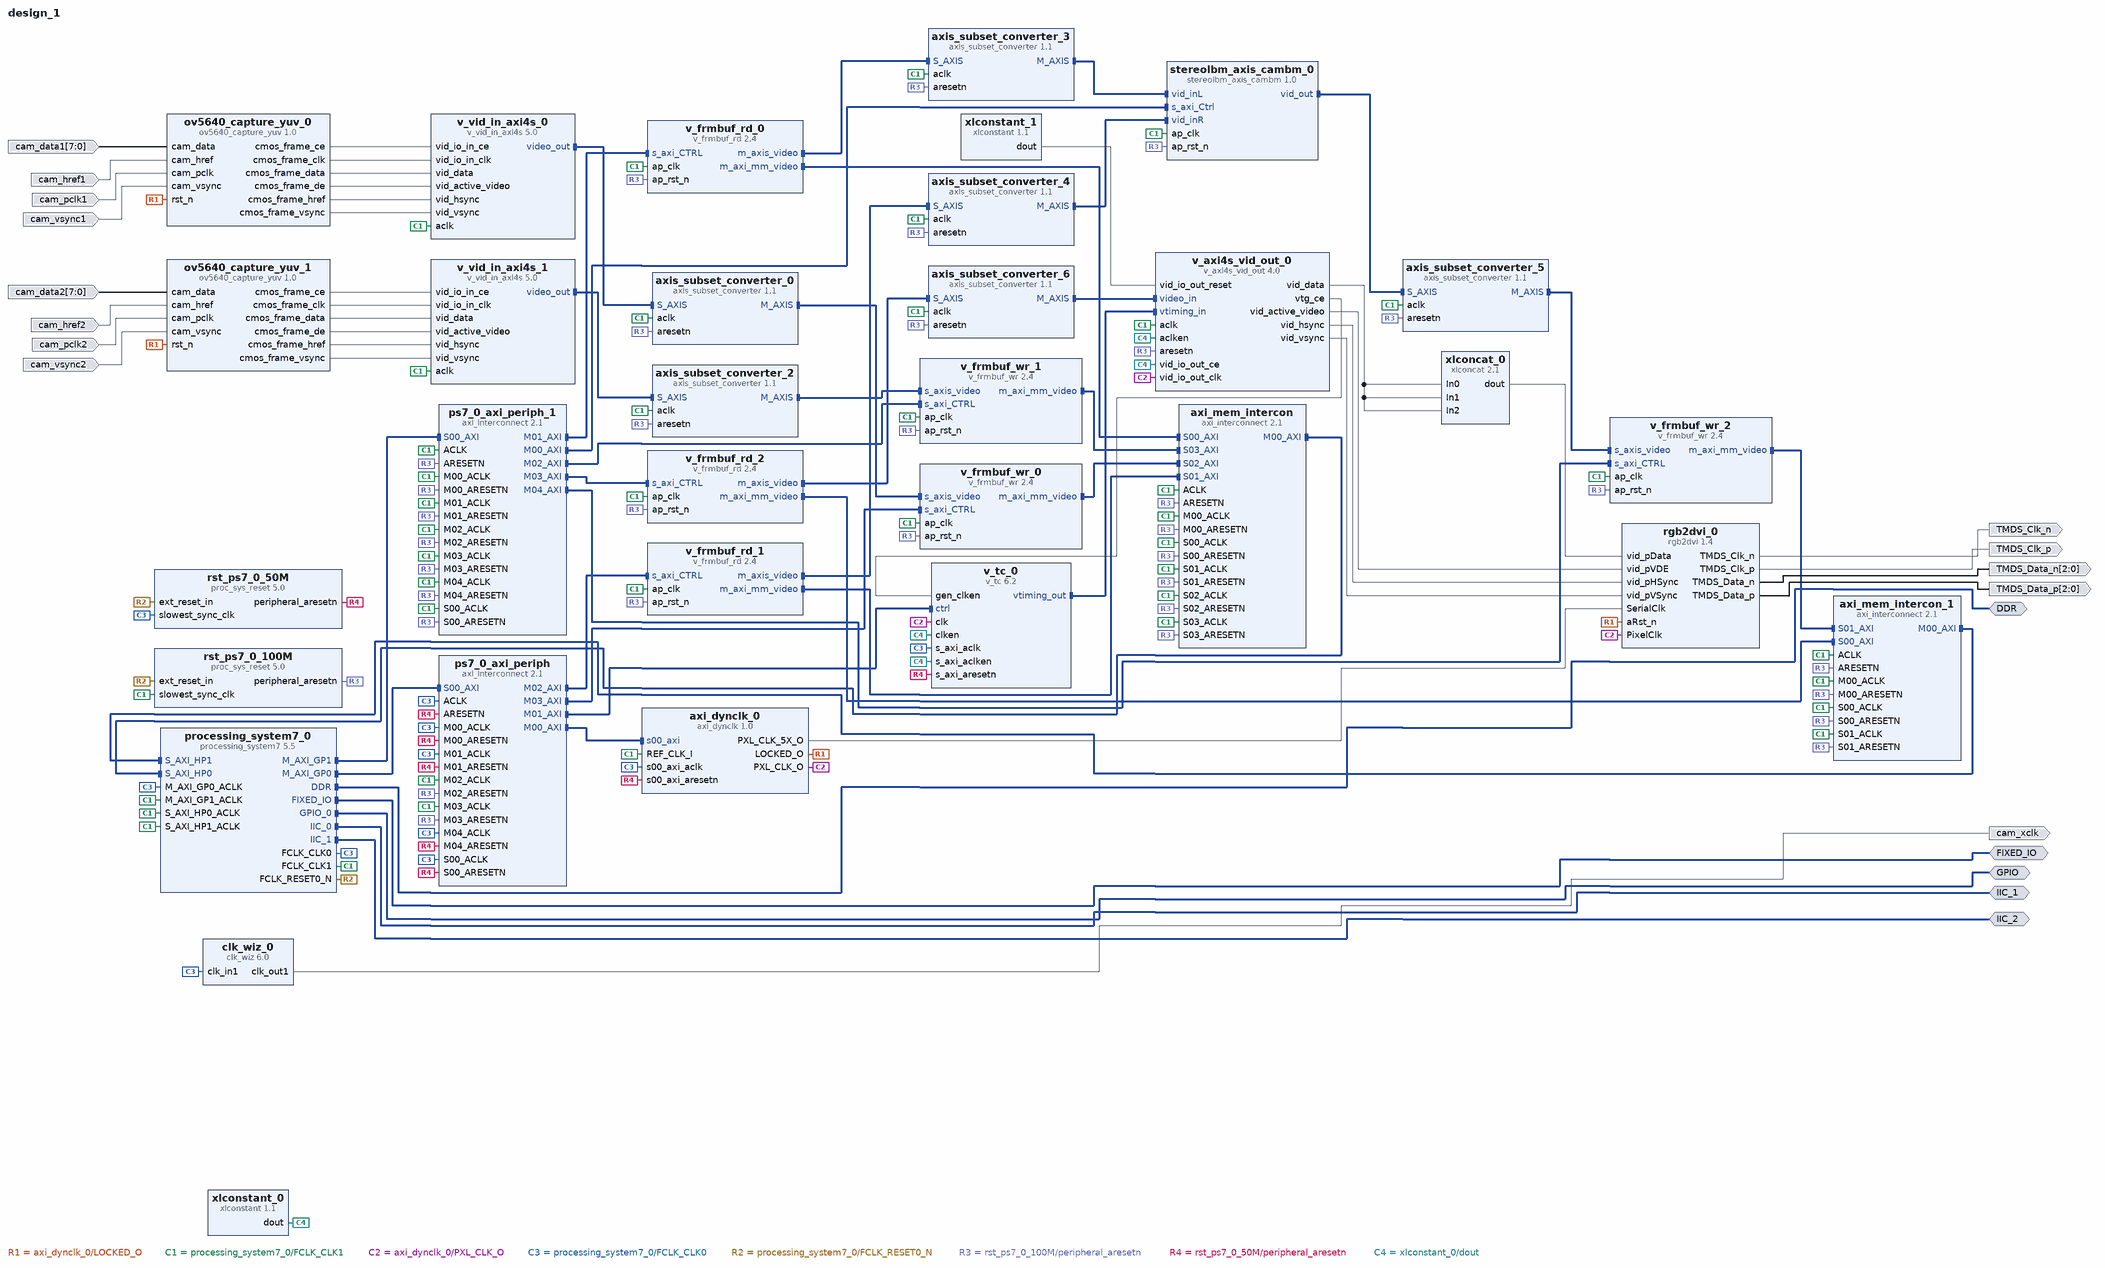
[diagram p0: block diagram of the top level]
# Vivado block design design_1, xc7z020clg400-1, Vivado 2023.1
create_bd_design design_1

create_bd_intf_port -mode Master -vlnv xilinx.com:interface:gpio_rtl:1.0 GPIO
create_bd_intf_port -mode Master -vlnv xilinx.com:interface:ddrx_rtl:1.0 DDR
create_bd_intf_port -mode Master -vlnv xilinx.com:display_processing_system7:fixedio_rtl:1.0 FIXED_IO
create_bd_intf_port -mode Master -vlnv xilinx.com:interface:iic_rtl:1.0 IIC_1
create_bd_intf_port -mode Master -vlnv xilinx.com:interface:iic_rtl:1.0 IIC_2
create_bd_port -dir O -type clk TMDS_Clk_p
create_bd_port -dir O -type clk TMDS_Clk_n
create_bd_port -dir O -from 2 -to 0 TMDS_Data_p
create_bd_port -dir O -from 2 -to 0 TMDS_Data_n
create_bd_port -dir I cam_pclk1
create_bd_port -dir I cam_vsync1
create_bd_port -dir I cam_href1
create_bd_port -dir I -from 7 -to 0 cam_data1
create_bd_port -dir O -type clk cam_xclk
create_bd_port -dir I -from 7 -to 0 cam_data2
create_bd_port -dir I cam_href2
create_bd_port -dir I cam_vsync2
create_bd_port -dir I cam_pclk2

create_bd_cell -type ip -vlnv xilinx.com:ip:v_tc:6.2 v_tc_0
set_property -dict {CONFIG.HAS_AXI4_LITE true CONFIG.VIDEO_MODE 720p CONFIG.enable_detection false} [get_bd_cells v_tc_0]
create_bd_cell -type ip -vlnv xilinx.com:ip:v_axi4s_vid_out:4.0 v_axi4s_vid_out_0
set_property -dict [list \
  CONFIG.C_ADDR_WIDTH 11 \
  CONFIG.C_HAS_ASYNC_CLK 1 \
  CONFIG.C_PIXELS_PER_CLOCK 1 \
  CONFIG.C_S_AXIS_VIDEO_FORMAT 12 \
] [get_bd_cells v_axi4s_vid_out_0]
create_bd_cell -type ip -vlnv xilinx.com:ip:xlconstant:1.1 xlconstant_0
set_property -dict {CONFIG.CONST_VAL 1} [get_bd_cells xlconstant_0]
create_bd_cell -type ip -vlnv xilinx.com:ip:proc_sys_reset:5.0 rst_ps7_0_100M
create_bd_cell -type ip -vlnv digilentinc.com:ip:rgb2dvi:1.4 rgb2dvi_0
set_property -dict {CONFIG.kGenerateSerialClk false CONFIG.kRstActiveHigh false} [get_bd_cells rgb2dvi_0]
create_bd_cell -type ip -vlnv digilentinc.com:ip:axi_dynclk:1.0 axi_dynclk_0
create_bd_cell -type ip -vlnv xilinx.com:ip:proc_sys_reset:5.0 rst_ps7_0_50M
create_bd_cell -type ip -vlnv xilinx.com:ip:xlconstant:1.1 xlconstant_1
set_property -dict {CONFIG.CONST_VAL 0} [get_bd_cells xlconstant_1]
create_bd_cell -type ip -vlnv xilinx.com:ip:v_frmbuf_wr:2.4 v_frmbuf_wr_0
set_property -dict [list \
  CONFIG.AXIMM_ADDR_WIDTH 32 \
  CONFIG.HAS_INTERLACED 0 \
  CONFIG.HAS_RGB8 0 \
  CONFIG.HAS_RGBX8 0 \
  CONFIG.HAS_Y8 1 \
  CONFIG.HAS_YUVX8 0 \
  CONFIG.HAS_YUYV8 0 \
  CONFIG.HAS_Y_U_V8 0 \
  CONFIG.MAX_COLS 4096 \
  CONFIG.MAX_DATA_WIDTH 8 \
  CONFIG.SAMPLES_PER_CLOCK 1 \
] [get_bd_cells v_frmbuf_wr_0]
create_bd_cell -type ip -vlnv xilinx.com:ip:v_frmbuf_rd:2.4 v_frmbuf_rd_0
set_property -dict [list \
  CONFIG.AXIMM_ADDR_WIDTH 32 \
  CONFIG.HAS_ALPHA 0 \
  CONFIG.HAS_INTERLACED 0 \
  CONFIG.HAS_RGB8 0 \
  CONFIG.HAS_RGBX8 0 \
  CONFIG.HAS_UYVY8 0 \
  CONFIG.HAS_Y8 1 \
  CONFIG.HAS_YUVX8 0 \
  CONFIG.HAS_YUYV8 0 \
  CONFIG.MAX_COLS 4096 \
  CONFIG.MAX_DATA_WIDTH 8 \
  CONFIG.SAMPLES_PER_CLOCK 1 \
] [get_bd_cells v_frmbuf_rd_0]
create_bd_cell -type ip -vlnv xilinx.com:ip:v_vid_in_axi4s:5.0 v_vid_in_axi4s_0
set_property -dict [list \
  CONFIG.C_ADDR_WIDTH 11 \
  CONFIG.C_HAS_ASYNC_CLK 1 \
  CONFIG.C_M_AXIS_VIDEO_FORMAT 0 \
] [get_bd_cells v_vid_in_axi4s_0]
create_bd_cell -type ip -vlnv xilinx.com:ip:clk_wiz:6.0 clk_wiz_0
set_property -dict [list \
  CONFIG.CLKIN1_JITTER_PS 200.0 \
  CONFIG.CLKIN2_JITTER_PS 100.0 \
  CONFIG.CLKOUT1_JITTER 239.726 \
  CONFIG.CLKOUT1_PHASE_ERROR 160.484 \
  CONFIG.CLKOUT1_REQUESTED_OUT_FREQ 24 \
  CONFIG.MMCM_CLKFBOUT_MULT_F 19.500 \
  CONFIG.MMCM_CLKIN1_PERIOD 20.000 \
  CONFIG.MMCM_CLKIN2_PERIOD 10.0 \
  CONFIG.MMCM_CLKOUT0_DIVIDE_F 40.625 \
  CONFIG.MMCM_DIVCLK_DIVIDE 1 \
  CONFIG.PRIM_IN_FREQ 50.000 \
  CONFIG.SECONDARY_SOURCE Single_ended_clock_capable_pin \
  CONFIG.USE_INCLK_SWITCHOVER false \
  CONFIG.USE_LOCKED false \
  CONFIG.USE_RESET false \
] [get_bd_cells clk_wiz_0]
create_bd_cell -type ip -vlnv xilinx.com:ip:processing_system7:5.5 processing_system7_0
set_property -dict [list \
  CONFIG.PCW_APU_PERIPHERAL_FREQMHZ 650 \
  CONFIG.PCW_CRYSTAL_PERIPHERAL_FREQMHZ 50 \
  CONFIG.PCW_EN_CLK1_PORT 1 \
  CONFIG.PCW_FCLK_CLK1_BUF TRUE \
  CONFIG.PCW_FPGA1_PERIPHERAL_FREQMHZ 100 \
  CONFIG.PCW_FPGA_FCLK1_ENABLE 1 \
  CONFIG.PCW_GPIO_EMIO_GPIO_ENABLE 1 \
  CONFIG.PCW_GPIO_EMIO_GPIO_IO 3 \
  CONFIG.PCW_GPIO_EMIO_GPIO_WIDTH 3 \
  CONFIG.PCW_I2C0_I2C0_IO EMIO \
  CONFIG.PCW_I2C0_PERIPHERAL_ENABLE 1 \
  CONFIG.PCW_I2C1_I2C1_IO EMIO \
  CONFIG.PCW_I2C1_PERIPHERAL_ENABLE 1 \
  CONFIG.PCW_I2C_PERIPHERAL_FREQMHZ 108.333336 \
  CONFIG.PCW_PRESET_BANK1_VOLTAGE {LVCMOS 1.8V} \
  CONFIG.PCW_SD0_GRP_CD_ENABLE 1 \
  CONFIG.PCW_SD0_GRP_CD_IO {MIO 47} \
  CONFIG.PCW_SD0_GRP_WP_ENABLE 0 \
  CONFIG.PCW_SD0_PERIPHERAL_ENABLE 1 \
  CONFIG.PCW_SD0_SD0_IO {MIO 40 .. 45} \
  CONFIG.PCW_SDIO_PERIPHERAL_FREQMHZ 100 \
  CONFIG.PCW_UART0_PERIPHERAL_ENABLE 1 \
  CONFIG.PCW_UART0_UART0_IO {MIO 14 .. 15} \
  CONFIG.PCW_UART_PERIPHERAL_FREQMHZ 100 \
  CONFIG.PCW_UIPARAM_DDR_BUS_WIDTH {16 Bit} \
  CONFIG.PCW_UIPARAM_DDR_FREQ_MHZ 525 \
  CONFIG.PCW_UIPARAM_DDR_PARTNO {MT41J256M16 RE-125} \
  CONFIG.PCW_UIPARAM_GENERATE_SUMMARY NONE \
  CONFIG.PCW_USE_M_AXI_GP1 1 \
  CONFIG.PCW_USE_S_AXI_HP0 1 \
  CONFIG.PCW_USE_S_AXI_HP1 1 \
] [get_bd_cells processing_system7_0]
# 73 more settings of processing_system7_0 are not shown: defaults, MIO pin electricals, DDR timing, and values the tool derives
create_bd_cell -type ip -vlnv xilinx.com:user:ov5640_capture_yuv:1.0 ov5640_capture_yuv_0
create_bd_cell -type ip -vlnv xilinx.com:ip:xlconcat:2.1 xlconcat_0
set_property -dict {CONFIG.IN0_WIDTH 8 CONFIG.IN1_WIDTH 8 CONFIG.IN2_WIDTH 8 CONFIG.NUM_PORTS 3} [get_bd_cells xlconcat_0]
create_bd_cell -type ip -vlnv xilinx.com:user:ov5640_capture_yuv:1.0 ov5640_capture_yuv_1
create_bd_cell -type ip -vlnv xilinx.com:ip:v_vid_in_axi4s:5.0 v_vid_in_axi4s_1
set_property -dict [list \
  CONFIG.C_ADDR_WIDTH 11 \
  CONFIG.C_HAS_ASYNC_CLK 1 \
  CONFIG.C_M_AXIS_VIDEO_FORMAT 0 \
] [get_bd_cells v_vid_in_axi4s_1]
create_bd_cell -type ip -vlnv xilinx.com:ip:v_frmbuf_wr:2.4 v_frmbuf_wr_1
set_property -dict [list \
  CONFIG.AXIMM_ADDR_WIDTH 32 \
  CONFIG.HAS_INTERLACED 0 \
  CONFIG.HAS_RGB8 0 \
  CONFIG.HAS_RGBX8 0 \
  CONFIG.HAS_Y8 1 \
  CONFIG.HAS_YUVX8 0 \
  CONFIG.HAS_YUYV8 0 \
  CONFIG.HAS_Y_U_V8 0 \
  CONFIG.MAX_COLS 4096 \
  CONFIG.MAX_DATA_WIDTH 8 \
  CONFIG.SAMPLES_PER_CLOCK 1 \
] [get_bd_cells v_frmbuf_wr_1]
create_bd_cell -type ip -vlnv xilinx.com:ip:v_frmbuf_rd:2.4 v_frmbuf_rd_1
set_property -dict [list \
  CONFIG.AXIMM_ADDR_WIDTH 32 \
  CONFIG.HAS_ALPHA 0 \
  CONFIG.HAS_INTERLACED 0 \
  CONFIG.HAS_RGB8 0 \
  CONFIG.HAS_RGBX8 0 \
  CONFIG.HAS_UYVY8 0 \
  CONFIG.HAS_Y8 1 \
  CONFIG.HAS_YUVX8 0 \
  CONFIG.HAS_YUYV8 0 \
  CONFIG.MAX_COLS 4096 \
  CONFIG.MAX_DATA_WIDTH 8 \
  CONFIG.SAMPLES_PER_CLOCK 1 \
] [get_bd_cells v_frmbuf_rd_1]
create_bd_cell -type ip -vlnv xilinx.com:ip:axis_subset_converter:1.1 axis_subset_converter_0
set_property -dict [list \
  CONFIG.M_TDATA_NUM_BYTES 3 \
  CONFIG.S_TDATA_NUM_BYTES 2 \
  CONFIG.TDATA_REMAP {16'b0000000000000000,tdata[7:0]} \
] [get_bd_cells axis_subset_converter_0]
create_bd_cell -type ip -vlnv xilinx.com:ip:axis_subset_converter:1.1 axis_subset_converter_2
set_property -dict [list \
  CONFIG.M_TDATA_NUM_BYTES 3 \
  CONFIG.S_TDATA_NUM_BYTES 2 \
  CONFIG.TDATA_REMAP {16'b0000000000000000,tdata[7:0]} \
] [get_bd_cells axis_subset_converter_2]
create_bd_cell -type ip -vlnv xilinx.com:ip:axis_subset_converter:1.1 axis_subset_converter_3
set_property -dict {CONFIG.M_TDATA_NUM_BYTES 1 CONFIG.S_TDATA_NUM_BYTES 3} [get_bd_cells axis_subset_converter_3]
create_bd_cell -type ip -vlnv xilinx.com:ip:axis_subset_converter:1.1 axis_subset_converter_4
set_property -dict {CONFIG.M_TDATA_NUM_BYTES 1 CONFIG.S_TDATA_NUM_BYTES 3} [get_bd_cells axis_subset_converter_4]
create_bd_cell -type ip -vlnv xilinx.com:ip:axi_interconnect:2.1 ps7_0_axi_periph
set_property -dict {CONFIG.NUM_MI 5} [get_bd_cells ps7_0_axi_periph]
create_bd_cell -type ip -vlnv xilinx.com:ip:axi_interconnect:2.1 ps7_0_axi_periph_1
set_property -dict {CONFIG.NUM_MI 5} [get_bd_cells ps7_0_axi_periph_1]
create_bd_cell -type ip -vlnv xilinx.com:ip:v_frmbuf_wr:2.4 v_frmbuf_wr_2
set_property -dict [list \
  CONFIG.HAS_RGB8 0 \
  CONFIG.HAS_Y8 1 \
  CONFIG.MAX_COLS 4096 \
  CONFIG.SAMPLES_PER_CLOCK 1 \
] [get_bd_cells v_frmbuf_wr_2]
create_bd_cell -type ip -vlnv xilinx.com:ip:axis_subset_converter:1.1 axis_subset_converter_5
set_property -dict {CONFIG.M_TDATA_NUM_BYTES 3 CONFIG.S_TDATA_NUM_BYTES 1} [get_bd_cells axis_subset_converter_5]
create_bd_cell -type ip -vlnv xilinx.com:ip:v_frmbuf_rd:2.4 v_frmbuf_rd_2
set_property -dict [list \
  CONFIG.HAS_RGB8 0 \
  CONFIG.HAS_Y8 1 \
  CONFIG.MAX_COLS 4096 \
  CONFIG.SAMPLES_PER_CLOCK 1 \
] [get_bd_cells v_frmbuf_rd_2]
create_bd_cell -type ip -vlnv xilinx.com:ip:axis_subset_converter:1.1 axis_subset_converter_6
set_property -dict {CONFIG.M_TDATA_NUM_BYTES 1 CONFIG.S_TDATA_NUM_BYTES 3} [get_bd_cells axis_subset_converter_6]
create_bd_cell -type ip -vlnv xilinx.com:ip:axi_interconnect:2.1 axi_mem_intercon
set_property -dict {CONFIG.NUM_MI 1 CONFIG.NUM_SI 4} [get_bd_cells axi_mem_intercon]
create_bd_cell -type ip -vlnv xilinx.com:ip:axi_interconnect:2.1 axi_mem_intercon_1
set_property -dict {CONFIG.NUM_MI 1 CONFIG.NUM_SI 2} [get_bd_cells axi_mem_intercon_1]
create_bd_cell -type ip -vlnv xilinx.com:hls:stereolbm_axis_cambm:1.0 stereolbm_axis_cambm_0

# ---- connections ----

connect_bd_intf_net [get_bd_intf_pins axi_mem_intercon_1/M00_AXI] [get_bd_intf_pins processing_system7_0/S_AXI_HP1]
connect_bd_intf_net [get_bd_intf_pins axi_mem_intercon/M00_AXI] [get_bd_intf_pins processing_system7_0/S_AXI_HP0]
connect_bd_intf_net [get_bd_intf_pins axis_subset_converter_0/M_AXIS] [get_bd_intf_pins v_frmbuf_wr_0/s_axis_video]
connect_bd_intf_net [get_bd_intf_pins axis_subset_converter_2/M_AXIS] [get_bd_intf_pins v_frmbuf_wr_1/s_axis_video]
connect_bd_intf_net [get_bd_intf_pins axis_subset_converter_3/M_AXIS] [get_bd_intf_pins stereolbm_axis_cambm_0/vid_inL]
connect_bd_intf_net [get_bd_intf_pins axis_subset_converter_4/M_AXIS] [get_bd_intf_pins stereolbm_axis_cambm_0/vid_inR]
connect_bd_intf_net [get_bd_intf_pins axis_subset_converter_5/M_AXIS] [get_bd_intf_pins v_frmbuf_wr_2/s_axis_video]
connect_bd_intf_net [get_bd_intf_pins axis_subset_converter_6/M_AXIS] [get_bd_intf_pins v_axi4s_vid_out_0/video_in]
connect_bd_intf_net [get_bd_intf_ports DDR] [get_bd_intf_pins processing_system7_0/DDR]
connect_bd_intf_net [get_bd_intf_ports FIXED_IO] [get_bd_intf_pins processing_system7_0/FIXED_IO]
connect_bd_intf_net [get_bd_intf_ports GPIO] [get_bd_intf_pins processing_system7_0/GPIO_0]
connect_bd_intf_net [get_bd_intf_ports IIC_1] [get_bd_intf_pins processing_system7_0/IIC_0]
connect_bd_intf_net [get_bd_intf_ports IIC_2] [get_bd_intf_pins processing_system7_0/IIC_1]
connect_bd_intf_net [get_bd_intf_pins processing_system7_0/M_AXI_GP0] [get_bd_intf_pins ps7_0_axi_periph/S00_AXI]
connect_bd_intf_net [get_bd_intf_pins processing_system7_0/M_AXI_GP1] [get_bd_intf_pins ps7_0_axi_periph_1/S00_AXI]
connect_bd_intf_net [get_bd_intf_pins stereolbm_axis_cambm_0/s_axi_Ctrl] [get_bd_intf_pins ps7_0_axi_periph_1/M00_AXI]
connect_bd_intf_net [get_bd_intf_pins ps7_0_axi_periph_1/M01_AXI] [get_bd_intf_pins v_frmbuf_rd_0/s_axi_CTRL]
connect_bd_intf_net [get_bd_intf_pins ps7_0_axi_periph_1/M02_AXI] [get_bd_intf_pins v_frmbuf_wr_1/s_axi_CTRL]
connect_bd_intf_net [get_bd_intf_pins ps7_0_axi_periph_1/M03_AXI] [get_bd_intf_pins v_frmbuf_rd_2/s_axi_CTRL]
connect_bd_intf_net [get_bd_intf_pins ps7_0_axi_periph_1/M04_AXI] [get_bd_intf_pins v_frmbuf_wr_2/s_axi_CTRL]
connect_bd_intf_net [get_bd_intf_pins ps7_0_axi_periph/M00_AXI] [get_bd_intf_pins axi_dynclk_0/s00_axi]
connect_bd_intf_net [get_bd_intf_pins ps7_0_axi_periph/M01_AXI] [get_bd_intf_pins v_tc_0/ctrl]
connect_bd_intf_net [get_bd_intf_pins ps7_0_axi_periph/M02_AXI] [get_bd_intf_pins v_frmbuf_rd_1/s_axi_CTRL]
connect_bd_intf_net [get_bd_intf_pins ps7_0_axi_periph/M03_AXI] [get_bd_intf_pins v_frmbuf_wr_0/s_axi_CTRL]
connect_bd_intf_net [get_bd_intf_pins stereolbm_axis_cambm_0/vid_out] [get_bd_intf_pins axis_subset_converter_5/S_AXIS]
connect_bd_intf_net [get_bd_intf_pins v_frmbuf_rd_0/m_axi_mm_video] [get_bd_intf_pins axi_mem_intercon/S00_AXI]
connect_bd_intf_net [get_bd_intf_pins axis_subset_converter_3/S_AXIS] [get_bd_intf_pins v_frmbuf_rd_0/m_axis_video]
connect_bd_intf_net [get_bd_intf_pins v_frmbuf_rd_1/m_axi_mm_video] [get_bd_intf_pins axi_mem_intercon/S01_AXI]
connect_bd_intf_net [get_bd_intf_pins v_frmbuf_rd_1/m_axis_video] [get_bd_intf_pins axis_subset_converter_4/S_AXIS]
connect_bd_intf_net [get_bd_intf_pins v_frmbuf_rd_2/m_axi_mm_video] [get_bd_intf_pins axi_mem_intercon_1/S00_AXI]
connect_bd_intf_net [get_bd_intf_pins v_frmbuf_rd_2/m_axis_video] [get_bd_intf_pins axis_subset_converter_6/S_AXIS]
connect_bd_intf_net [get_bd_intf_pins v_frmbuf_wr_0/m_axi_mm_video] [get_bd_intf_pins axi_mem_intercon/S02_AXI]
connect_bd_intf_net [get_bd_intf_pins v_frmbuf_wr_1/m_axi_mm_video] [get_bd_intf_pins axi_mem_intercon/S03_AXI]
connect_bd_intf_net [get_bd_intf_pins v_frmbuf_wr_2/m_axi_mm_video] [get_bd_intf_pins axi_mem_intercon_1/S01_AXI]
connect_bd_intf_net [get_bd_intf_pins v_axi4s_vid_out_0/vtiming_in] [get_bd_intf_pins v_tc_0/vtiming_out]
connect_bd_intf_net [get_bd_intf_pins v_vid_in_axi4s_0/video_out] [get_bd_intf_pins axis_subset_converter_0/S_AXIS]
connect_bd_intf_net [get_bd_intf_pins v_vid_in_axi4s_1/video_out] [get_bd_intf_pins axis_subset_converter_2/S_AXIS]
connect_bd_net [get_bd_pins axi_dynclk_0/LOCKED_O] \
  [get_bd_pins rgb2dvi_0/aRst_n] [get_bd_pins ov5640_capture_yuv_0/rst_n] [get_bd_pins ov5640_capture_yuv_1/rst_n]
connect_bd_net [get_bd_pins axi_dynclk_0/PXL_CLK_5X_O] [get_bd_pins rgb2dvi_0/SerialClk]
connect_bd_net -net cam_data1_1 [get_bd_ports cam_data1] [get_bd_pins ov5640_capture_yuv_0/cam_data]
connect_bd_net -net cam_data_0_1 [get_bd_ports cam_data2] [get_bd_pins ov5640_capture_yuv_1/cam_data]
connect_bd_net -net cam_href1_1 [get_bd_ports cam_href1] [get_bd_pins ov5640_capture_yuv_0/cam_href]
connect_bd_net -net cam_href_0_1 [get_bd_ports cam_href2] [get_bd_pins ov5640_capture_yuv_1/cam_href]
connect_bd_net -net cam_pclk1_1 [get_bd_ports cam_pclk1] [get_bd_pins ov5640_capture_yuv_0/cam_pclk]
connect_bd_net -net cam_pclk_0_1 [get_bd_ports cam_pclk2] [get_bd_pins ov5640_capture_yuv_1/cam_pclk]
connect_bd_net -net cam_vsync1_1 [get_bd_ports cam_vsync1] [get_bd_pins ov5640_capture_yuv_0/cam_vsync]
connect_bd_net -net cam_vsync_0_1 [get_bd_ports cam_vsync2] [get_bd_pins ov5640_capture_yuv_1/cam_vsync]
connect_bd_net [get_bd_pins clk_wiz_0/clk_out1] [get_bd_ports cam_xclk]
connect_bd_net [get_bd_pins ov5640_capture_yuv_0/cmos_frame_ce] [get_bd_pins v_vid_in_axi4s_0/vid_io_in_ce]
connect_bd_net [get_bd_pins ov5640_capture_yuv_0/cmos_frame_clk] [get_bd_pins v_vid_in_axi4s_0/vid_io_in_clk]
connect_bd_net [get_bd_pins ov5640_capture_yuv_0/cmos_frame_data] [get_bd_pins v_vid_in_axi4s_0/vid_data]
connect_bd_net [get_bd_pins ov5640_capture_yuv_0/cmos_frame_de] [get_bd_pins v_vid_in_axi4s_0/vid_active_video]
connect_bd_net [get_bd_pins ov5640_capture_yuv_0/cmos_frame_href] [get_bd_pins v_vid_in_axi4s_0/vid_hsync]
connect_bd_net [get_bd_pins ov5640_capture_yuv_0/cmos_frame_vsync] [get_bd_pins v_vid_in_axi4s_0/vid_vsync]
connect_bd_net [get_bd_pins ov5640_capture_yuv_1/cmos_frame_ce] [get_bd_pins v_vid_in_axi4s_1/vid_io_in_ce]
connect_bd_net [get_bd_pins ov5640_capture_yuv_1/cmos_frame_clk] [get_bd_pins v_vid_in_axi4s_1/vid_io_in_clk]
connect_bd_net [get_bd_pins ov5640_capture_yuv_1/cmos_frame_data] [get_bd_pins v_vid_in_axi4s_1/vid_data]
connect_bd_net [get_bd_pins ov5640_capture_yuv_1/cmos_frame_de] [get_bd_pins v_vid_in_axi4s_1/vid_active_video]
connect_bd_net [get_bd_pins ov5640_capture_yuv_1/cmos_frame_href] [get_bd_pins v_vid_in_axi4s_1/vid_hsync]
connect_bd_net [get_bd_pins ov5640_capture_yuv_1/cmos_frame_vsync] [get_bd_pins v_vid_in_axi4s_1/vid_vsync]
connect_bd_net [get_bd_pins processing_system7_0/FCLK_CLK1] \
  [get_bd_pins v_axi4s_vid_out_0/aclk] [get_bd_pins axi_dynclk_0/REF_CLK_I] [get_bd_pins v_vid_in_axi4s_0/aclk] \
  [get_bd_pins rst_ps7_0_100M/slowest_sync_clk] [get_bd_pins v_frmbuf_rd_0/ap_clk] [get_bd_pins v_frmbuf_wr_0/ap_clk] \
  [get_bd_pins processing_system7_0/S_AXI_HP0_ACLK] [get_bd_pins v_vid_in_axi4s_1/aclk] [get_bd_pins v_frmbuf_wr_1/ap_clk] \
  [get_bd_pins v_frmbuf_rd_1/ap_clk] [get_bd_pins axis_subset_converter_0/aclk] [get_bd_pins axis_subset_converter_2/aclk] \
  [get_bd_pins axis_subset_converter_3/aclk] [get_bd_pins axis_subset_converter_4/aclk] \
  [get_bd_pins processing_system7_0/M_AXI_GP1_ACLK] [get_bd_pins ps7_0_axi_periph_1/ACLK] \
  [get_bd_pins ps7_0_axi_periph_1/S00_ACLK] [get_bd_pins ps7_0_axi_periph_1/M00_ACLK] \
  [get_bd_pins ps7_0_axi_periph_1/M01_ACLK] [get_bd_pins ps7_0_axi_periph/M02_ACLK] [get_bd_pins ps7_0_axi_periph/M03_ACLK] \
  [get_bd_pins ps7_0_axi_periph_1/M02_ACLK] [get_bd_pins processing_system7_0/S_AXI_HP1_ACLK] \
  [get_bd_pins axis_subset_converter_5/aclk] [get_bd_pins axis_subset_converter_6/aclk] [get_bd_pins v_frmbuf_rd_2/ap_clk] \
  [get_bd_pins v_frmbuf_wr_2/ap_clk] [get_bd_pins ps7_0_axi_periph_1/M03_ACLK] [get_bd_pins ps7_0_axi_periph_1/M04_ACLK] \
  [get_bd_pins axi_mem_intercon/ACLK] [get_bd_pins axi_mem_intercon/S00_ACLK] [get_bd_pins axi_mem_intercon/M00_ACLK] \
  [get_bd_pins axi_mem_intercon/S01_ACLK] [get_bd_pins axi_mem_intercon/S02_ACLK] [get_bd_pins axi_mem_intercon/S03_ACLK] \
  [get_bd_pins axi_mem_intercon_1/ACLK] [get_bd_pins axi_mem_intercon_1/S00_ACLK] [get_bd_pins axi_mem_intercon_1/M00_ACLK] \
  [get_bd_pins axi_mem_intercon_1/S01_ACLK] [get_bd_pins stereolbm_axis_cambm_0/ap_clk]
connect_bd_net -net processing_system7_0_FCLK_CLK1 [get_bd_pins axi_dynclk_0/PXL_CLK_O] \
  [get_bd_pins v_axi4s_vid_out_0/vid_io_out_clk] [get_bd_pins v_tc_0/clk] [get_bd_pins rgb2dvi_0/PixelClk]
connect_bd_net [get_bd_pins processing_system7_0/FCLK_CLK0] \
  [get_bd_pins v_tc_0/s_axi_aclk] [get_bd_pins axi_dynclk_0/s00_axi_aclk] [get_bd_pins rst_ps7_0_50M/slowest_sync_clk] \
  [get_bd_pins clk_wiz_0/clk_in1] [get_bd_pins processing_system7_0/M_AXI_GP0_ACLK] [get_bd_pins ps7_0_axi_periph/ACLK] \
  [get_bd_pins ps7_0_axi_periph/S00_ACLK] [get_bd_pins ps7_0_axi_periph/M00_ACLK] [get_bd_pins ps7_0_axi_periph/M01_ACLK] \
  [get_bd_pins ps7_0_axi_periph/M04_ACLK]
connect_bd_net [get_bd_pins processing_system7_0/FCLK_RESET0_N] [get_bd_pins rst_ps7_0_50M/ext_reset_in] [get_bd_pins rst_ps7_0_100M/ext_reset_in]
connect_bd_net [get_bd_pins rgb2dvi_0/TMDS_Clk_n] [get_bd_ports TMDS_Clk_n]
connect_bd_net [get_bd_pins rgb2dvi_0/TMDS_Clk_p] [get_bd_ports TMDS_Clk_p]
connect_bd_net [get_bd_pins rgb2dvi_0/TMDS_Data_n] [get_bd_ports TMDS_Data_n]
connect_bd_net [get_bd_pins rgb2dvi_0/TMDS_Data_p] [get_bd_ports TMDS_Data_p]
connect_bd_net [get_bd_pins rst_ps7_0_100M/peripheral_aresetn] \
  [get_bd_pins v_axi4s_vid_out_0/aresetn] [get_bd_pins v_frmbuf_rd_0/ap_rst_n] [get_bd_pins v_frmbuf_wr_0/ap_rst_n] \
  [get_bd_pins v_frmbuf_rd_1/ap_rst_n] [get_bd_pins v_frmbuf_wr_1/ap_rst_n] [get_bd_pins axis_subset_converter_2/aresetn] \
  [get_bd_pins axis_subset_converter_0/aresetn] [get_bd_pins axis_subset_converter_3/aresetn] \
  [get_bd_pins axis_subset_converter_4/aresetn] [get_bd_pins ps7_0_axi_periph_1/S00_ARESETN] \
  [get_bd_pins ps7_0_axi_periph_1/M00_ARESETN] [get_bd_pins ps7_0_axi_periph_1/ARESETN] \
  [get_bd_pins ps7_0_axi_periph_1/M01_ARESETN] [get_bd_pins ps7_0_axi_periph/M02_ARESETN] \
  [get_bd_pins ps7_0_axi_periph/M03_ARESETN] [get_bd_pins ps7_0_axi_periph_1/M02_ARESETN] \
  [get_bd_pins axis_subset_converter_5/aresetn] [get_bd_pins axis_subset_converter_6/aresetn] \
  [get_bd_pins v_frmbuf_rd_2/ap_rst_n] [get_bd_pins v_frmbuf_wr_2/ap_rst_n] [get_bd_pins ps7_0_axi_periph_1/M03_ARESETN] \
  [get_bd_pins ps7_0_axi_periph_1/M04_ARESETN] [get_bd_pins axi_mem_intercon/S00_ARESETN] \
  [get_bd_pins axi_mem_intercon/M00_ARESETN] [get_bd_pins axi_mem_intercon/ARESETN] \
  [get_bd_pins axi_mem_intercon/S01_ARESETN] [get_bd_pins axi_mem_intercon/S02_ARESETN] \
  [get_bd_pins axi_mem_intercon/S03_ARESETN] [get_bd_pins axi_mem_intercon_1/S00_ARESETN] \
  [get_bd_pins axi_mem_intercon_1/M00_ARESETN] [get_bd_pins axi_mem_intercon_1/ARESETN] \
  [get_bd_pins axi_mem_intercon_1/S01_ARESETN] [get_bd_pins stereolbm_axis_cambm_0/ap_rst_n]
connect_bd_net [get_bd_pins rst_ps7_0_50M/peripheral_aresetn] \
  [get_bd_pins v_tc_0/s_axi_aresetn] [get_bd_pins axi_dynclk_0/s00_axi_aresetn] [get_bd_pins ps7_0_axi_periph/S00_ARESETN] \
  [get_bd_pins ps7_0_axi_periph/M00_ARESETN] [get_bd_pins ps7_0_axi_periph/ARESETN] \
  [get_bd_pins ps7_0_axi_periph/M01_ARESETN] [get_bd_pins ps7_0_axi_periph/M04_ARESETN]
connect_bd_net [get_bd_pins v_axi4s_vid_out_0/vid_active_video] [get_bd_pins rgb2dvi_0/vid_pVDE]
connect_bd_net [get_bd_pins v_axi4s_vid_out_0/vid_hsync] [get_bd_pins rgb2dvi_0/vid_pHSync]
connect_bd_net [get_bd_pins v_axi4s_vid_out_0/vid_vsync] [get_bd_pins rgb2dvi_0/vid_pVSync]
connect_bd_net [get_bd_pins v_axi4s_vid_out_0/vtg_ce] [get_bd_pins v_tc_0/gen_clken]
connect_bd_net [get_bd_pins xlconcat_0/dout] [get_bd_pins rgb2dvi_0/vid_pData]
connect_bd_net [get_bd_pins xlconstant_0/dout] \
  [get_bd_pins v_axi4s_vid_out_0/aclken] [get_bd_pins v_axi4s_vid_out_0/vid_io_out_ce] [get_bd_pins v_tc_0/clken] \
  [get_bd_pins v_tc_0/s_axi_aclken]
connect_bd_net [get_bd_pins xlconstant_1/dout] [get_bd_pins v_axi4s_vid_out_0/vid_io_out_reset]
connect_bd_net -net xlslice_0_Dout [get_bd_pins v_axi4s_vid_out_0/vid_data] \
  [get_bd_pins xlconcat_0/In0] [get_bd_pins xlconcat_0/In1] [get_bd_pins xlconcat_0/In2]

# ---- address map ----
assign_bd_address -offset 0x44A00000 -range 64K -target_address_space [get_bd_addr_spaces processing_system7_0/Data] [get_bd_addr_segs axi_dynclk_0/s00_axi/reg0]
assign_bd_address -offset 0x44A10000 -range 64K -target_address_space [get_bd_addr_spaces processing_system7_0/Data] [get_bd_addr_segs v_frmbuf_rd_1/s_axi_CTRL/Reg]
assign_bd_address -offset 0x44A20000 -range 64K -target_address_space [get_bd_addr_spaces processing_system7_0/Data] [get_bd_addr_segs v_frmbuf_wr_0/s_axi_CTRL/Reg]
assign_bd_address -offset 0x44A30000 -range 64K -target_address_space [get_bd_addr_spaces processing_system7_0/Data] [get_bd_addr_segs v_tc_0/ctrl/Reg]
assign_bd_address -offset 0x80000000 -range 64K -target_address_space [get_bd_addr_spaces processing_system7_0/Data] [get_bd_addr_segs stereolbm_axis_cambm_0/s_axi_Ctrl/Reg]
assign_bd_address -offset 0x84A00000 -range 64K -target_address_space [get_bd_addr_spaces processing_system7_0/Data] [get_bd_addr_segs v_frmbuf_rd_0/s_axi_CTRL/Reg]
assign_bd_address -offset 0x84A10000 -range 64K -target_address_space [get_bd_addr_spaces processing_system7_0/Data] [get_bd_addr_segs v_frmbuf_rd_2/s_axi_CTRL/Reg]
assign_bd_address -offset 0x84A20000 -range 64K -target_address_space [get_bd_addr_spaces processing_system7_0/Data] [get_bd_addr_segs v_frmbuf_wr_1/s_axi_CTRL/Reg]
assign_bd_address -offset 0x84A30000 -range 64K -target_address_space [get_bd_addr_spaces processing_system7_0/Data] [get_bd_addr_segs v_frmbuf_wr_2/s_axi_CTRL/Reg]
assign_bd_address -offset 0x00000000 -range 512M -target_address_space [get_bd_addr_spaces v_frmbuf_rd_0/Data_m_axi_mm_video] [get_bd_addr_segs processing_system7_0/S_AXI_HP0/HP0_DDR_LOWOCM]
assign_bd_address -offset 0x00000000 -range 512M -target_address_space [get_bd_addr_spaces v_frmbuf_rd_1/Data_m_axi_mm_video] [get_bd_addr_segs processing_system7_0/S_AXI_HP0/HP0_DDR_LOWOCM]
assign_bd_address -offset 0x00000000 -range 512M -target_address_space [get_bd_addr_spaces v_frmbuf_rd_2/Data_m_axi_mm_video] [get_bd_addr_segs processing_system7_0/S_AXI_HP1/HP1_DDR_LOWOCM]
assign_bd_address -offset 0x00000000 -range 512M -target_address_space [get_bd_addr_spaces v_frmbuf_wr_0/Data_m_axi_mm_video] [get_bd_addr_segs processing_system7_0/S_AXI_HP0/HP0_DDR_LOWOCM]
assign_bd_address -offset 0x00000000 -range 512M -target_address_space [get_bd_addr_spaces v_frmbuf_wr_1/Data_m_axi_mm_video] [get_bd_addr_segs processing_system7_0/S_AXI_HP0/HP0_DDR_LOWOCM]
assign_bd_address -offset 0x00000000 -range 512M -target_address_space [get_bd_addr_spaces v_frmbuf_wr_2/Data_m_axi_mm_video] [get_bd_addr_segs processing_system7_0/S_AXI_HP1/HP1_DDR_LOWOCM]

validate_bd_design
save_bd_design
